# EAGLE schematic Temperature Sensor Rev.2 (EAGLE 7.6.0)
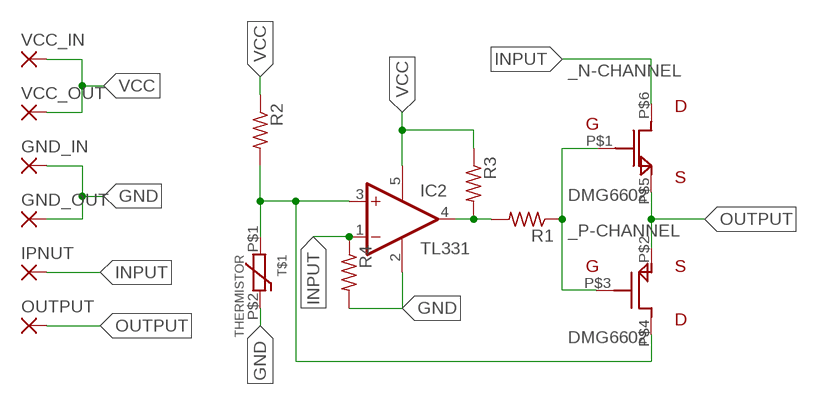
[diagram p0: schematic, sheet 1]

## Parts
_  DMG6602  [SOT23-6]
GND_IN  1,6/0,8  [1,6/0,8]
GND_OUT  1,6/0,8  [1,6/0,8]
IC2  TL331  [DBV-R-PDSO-G5]
IPNUT  1,6/0,8  [1,6/0,8]
OUTPUT  1,6/0,8  [1,6/0,8]
R1  R-US_R0603  [R0603]
R2  R-US_R0603  [R0603]
R3  R-US_R0603  [R0603]
R4  R-US_R0603  [R0603]
T$1  THERMISTOR  [0603]
VCC_IN  1,6/0,8  [1,6/0,8]
VCC_OUT  1,6/0,8  [1,6/0,8]

## Nets
COMP_OUT: IC2.4(OUT) R1.2 R3.2
GND: GND_IN.1(P) GND_OUT.1(P) IC2.2(GND) R4.2 T$1.P$2
INPUT: _.P$6(N-CHANNEL:D$1) IC2.1(-IN) IPNUT.1(P) R4.1
MOS_IN: _.P$1(N-CHANNEL:G$1) _.P$3(P-CHANNEL:G$1) R1.1
OUTPUT: _.P$2(P-CHANNEL:S$1) _.P$5(N-CHANNEL:S$1) OUTPUT.1(P)
THERM_OUT: _.P$4(P-CHANNEL:D$1) IC2.3(+IN) R2.2 T$1.P$1
VCC: IC2.5(V+) R2.1 R3.1 VCC_IN.1(P) VCC_OUT.1(P)

## Library data of the parts
_ = formula electric:DMG6602: N and P Channel Mosfet
GND_IN GND_OUT IPNUT OUTPUT VCC_IN VCC_OUT = wirepad:1,6/0,8: THROUGH-HOLE PAD
IC2 = linear:TL331: SINGLE DIFFERENTIAL COMPARATOR Source: Data sheet <http://www.ti.com/lit/ds/symlink/tl331-q1.pdf>
R1-R4 = resistor:R-US_: RESISTOR, American symbol
T$1 = formula electric:THERMISTOR